# Altium schematic sheet door_clock.SchDoc
size 420 x 297 mm; SheetNumber: 2; SheetTotal: 2
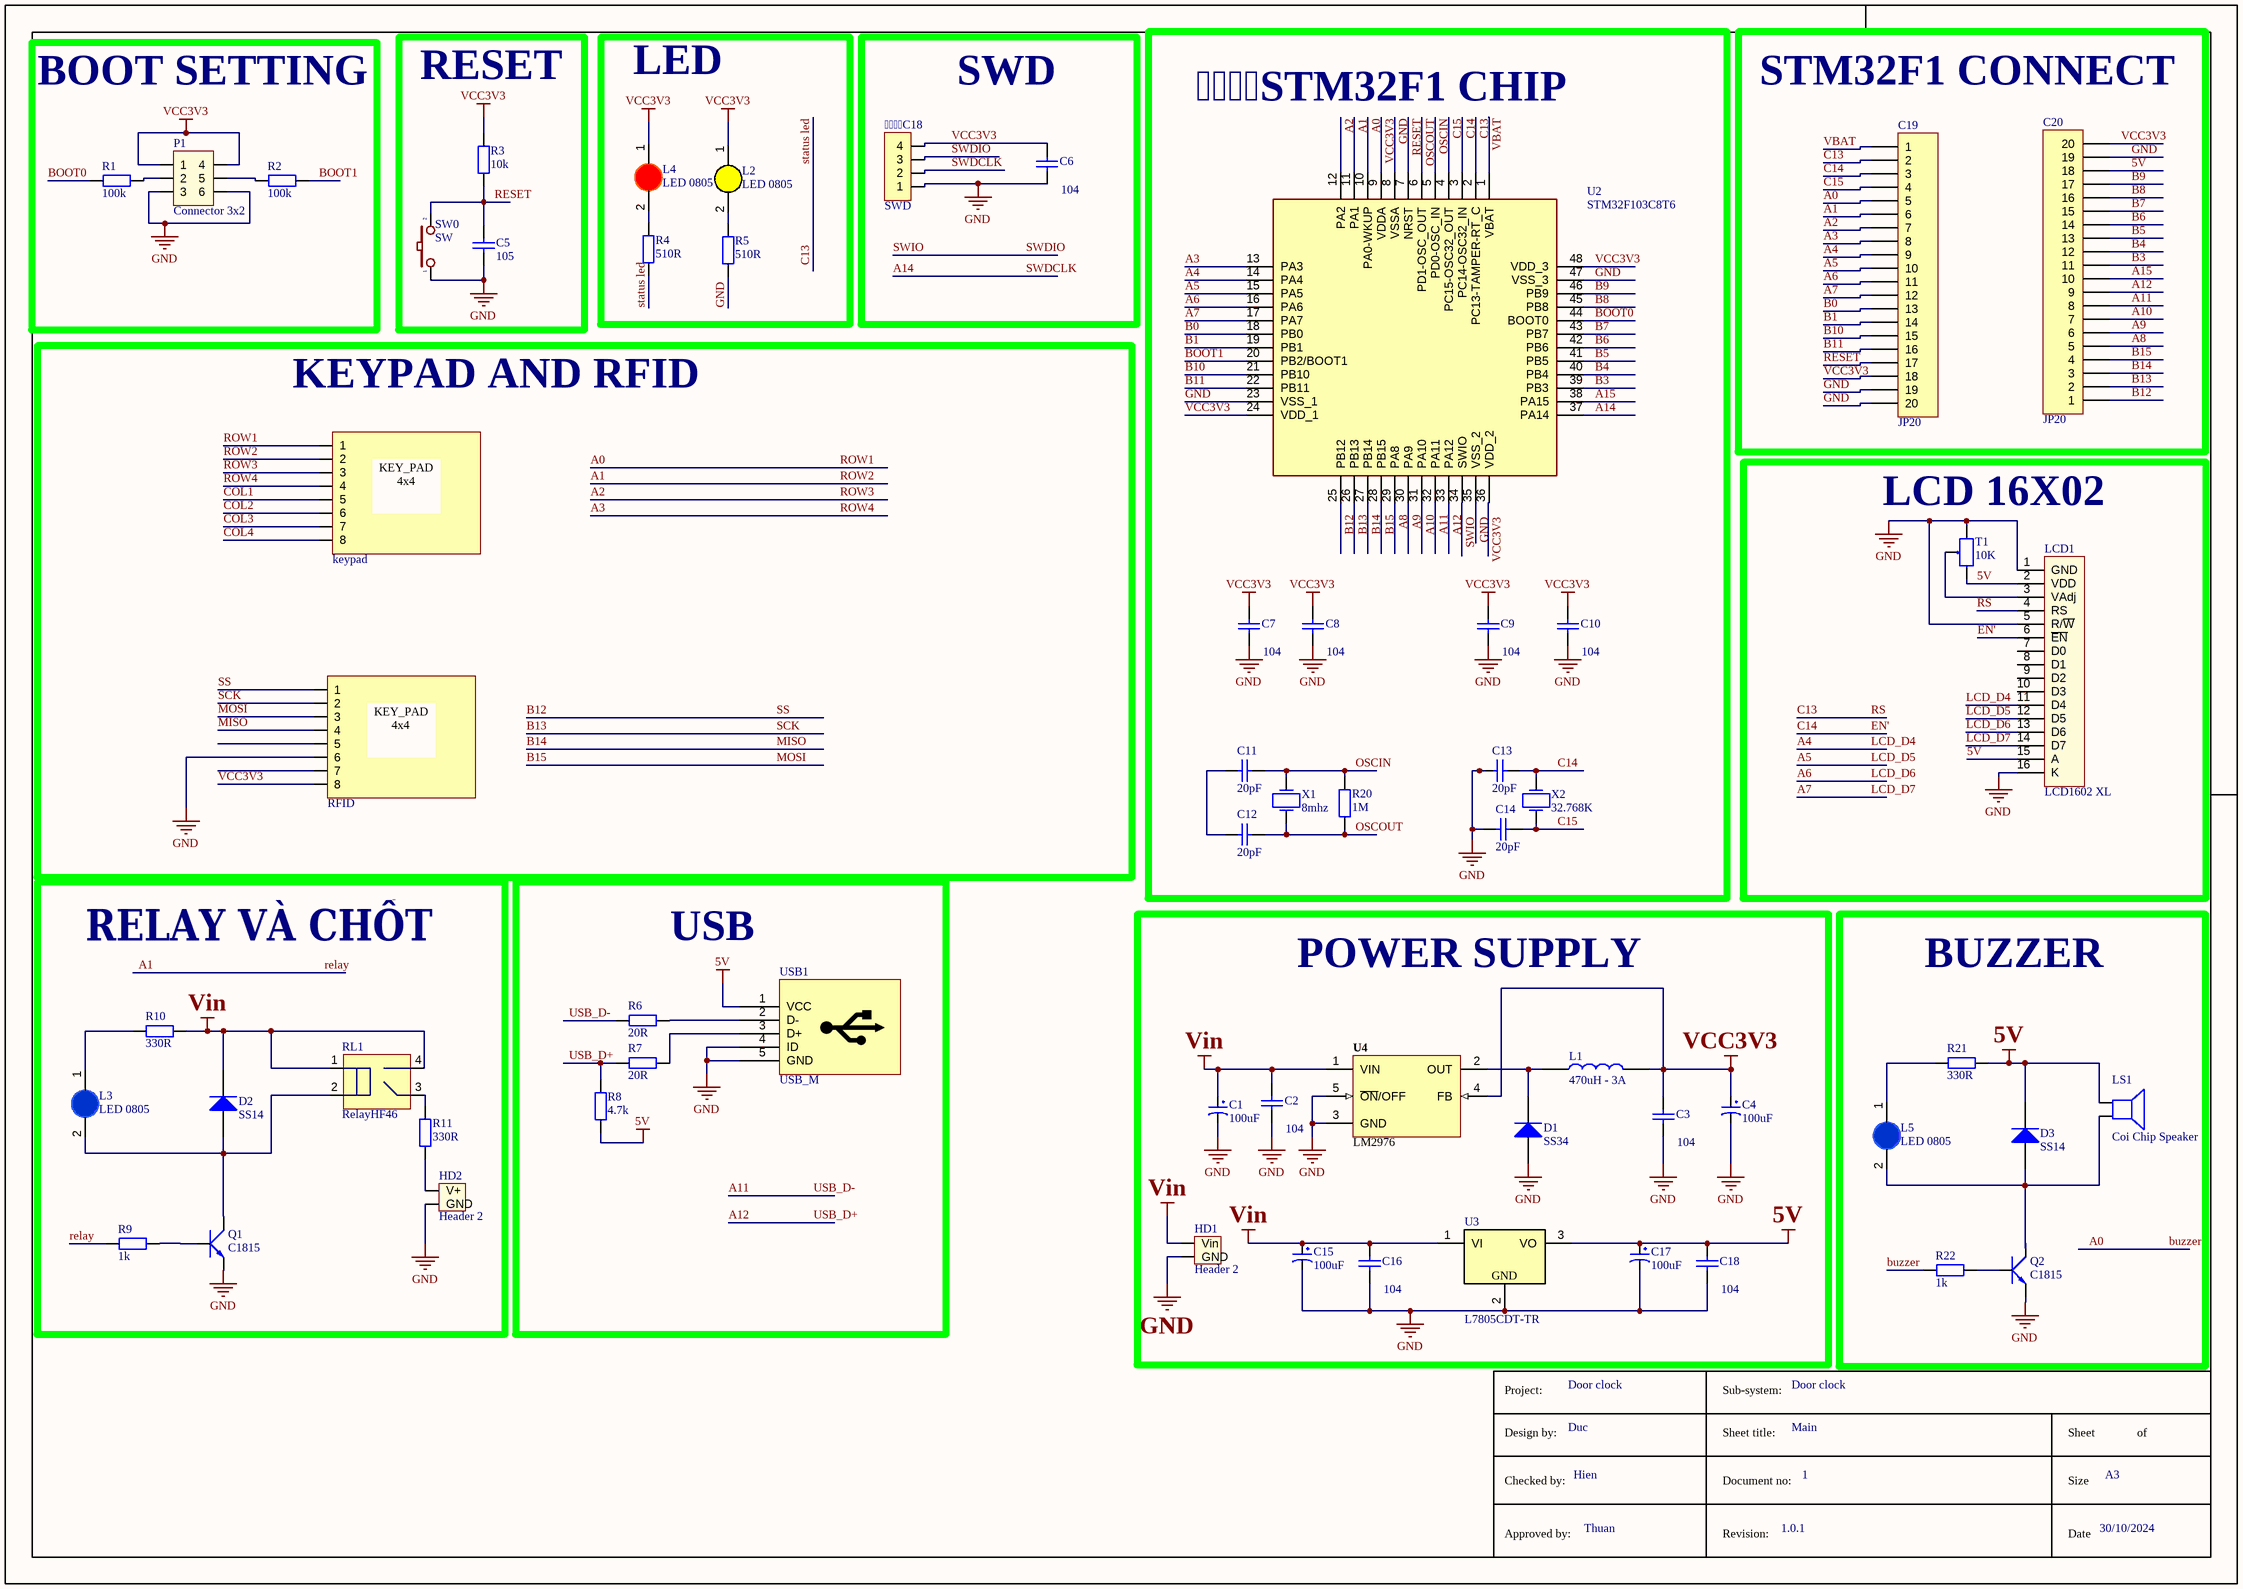
[diagram p0: door_clock.SchDoc]

## Parts
C18  SWD  [JP4-C1T]
C1  100uF  [tu hoa 8mm]
C2  104  [tu 0805]
C3  104  [tu 0805]
C4  100uF  [tu hoa 8mm]
C5  105  [tu 0603]
C6  104  [tu 0805]
C7  104  [tu 0805]
C8  104  [tu 0805]
C9  104  [tu 0805]
C10  104  [tu 0805]
C11  20pF  [tu 0805]
C12  20pF  [tu 0805]
C13  20pF  [tu 0805]
C14  20pF  [tu 0805]
C15  100uF  [tu hoa 8mm]
C16  104  [tu 0805]
C17  100uF  [tu hoa 8mm]
C18  104  [tu 0805]
C19  JP20  [JP20-C1T]
C20  JP20  [JP20-C1T]
D1  SS34  [DIODE SMA]
D2  SS14  [DIODE SMA]
D3  SS14  [DIODE SMA]
HD1  Header 2  [HED2]
HD2  Header 2  [HED2]
JP25  keypad  [JP 1x8 DT]
JP26  RFID  [JP 1x8 DT]
L1  470uH - 3A  [CUON CAM 100uH3A]
L2  LED 0805  [LED-0805-Yellow]
L3  LED 0805  [LED-0805-Blue]
L4  LED 0805  [LED-0805-Red]
L5  LED 0805  [LED-0805-Blue]
LCD1  LCD1602 XL  [LCD1602 with Jump]
LS1  Coi Chip Speaker  [Coi Chip Speacker]
P1  Connector 3x2  [JP3x2]
Q1  C1815  [TO92]
Q2  C1815  [TO92]
R1  100k  [tro smd 0603]
R2  100k  [tro smd 0603]
R3  10k  [tro smd 0603]
R4  510R  [tro smd 0603]
R5  510R  [tro smd 0603]
R6  20R  [tro smd 1206]
R7  20R  [tro smd 1206]
R8  4.7k  [tro smd 0603]
R9  1k  [tro smd 0805]
R10  330R  [Tro SMD 0805]
R11  330R  [Tro SMD 0805]
R20  1M  [tro smd 0805]
R21  330R  [Tro SMD 0805]
R22  1k  [tro smd 0805]
RL1  RelayHF46  [Relay 4 chan HF46F]
SW0  SW  [SW2]
T1  10K  [Bien Tro Vi Chinh Dung]
U2  STM32F103C8T6  [LQFP-48_19.6_393_58X11_SMD]
U3  L7805CDT-TR  [DPAK_118_446_112X59_SMD]
U4  LM2976  [TO263]
USB1  USB_M  [USB_B_MINI]
X1  8mhz  [XTAL_THG_HC49/US]
X2  32.768K  [XTAL_SMD3215]

## Blocks framed on the sheet
BOOT SETTING: P1 R1 R2
RESET: C5 R3 SW0
LED: L2 L4 R4 R5
SWD: C18 C6
STM32F1 CHIP: C7-C14 R20 U2 X1 X2
STM32F1 CONNECT: C19 C20
KEYPAD AND RFID: JP25 JP26
LCD 16X02: LCD1 T1
RELAY VÀ CHỐT: D2 HD2 L3 Q1 R9-R11 RL1
USB: R6-R8 USB1
POWER SUPPLY: C1-C4 C15-C18 D1 HD1 L1 U3 U4
BUZZER: D3 L5 LS1 Q2 R21 R22

## Nets
5V: C17.1 C18.1 C20.18 D3.2(K) LCD1.2(VDD) LCD1.15(A) LS1.1 R8.1 R21.2 T1.1 U3.3(VO) USB1.1(VCC)
GND: C18.1 C1.2 C2.2 C3.2 C4.2 C5.2 C6.2 C7.2 C8.2 C9.2 C10.2 C13.2 C14.2 C15.2 C16.2 C17.2 C18.2 C19.19 C19.20 C20.19 D1.1(A) HD1.2(GND) HD2.2(GND) JP26.6 LCD1.1(GND) LCD1.5(R/~{W}) LCD1.16(K) P1.3 P1.6 Q1.1(E) Q2.1(E) R5.1 SW0.1 T1.3 U2.8(VSSA) U2.23(VSS_1) U2.35(VSS_2) U2.47(VSS_3) U3.2 U4.3(GND) U4.5(~{ON}/OFF) USB1.4(ID) USB1.5(GND)
VCC3V3: C18.4 C3.1 C4.1 C6.1 C7.1 C8.1 C9.1 C10.1 C19.18 C20.20 JP26.8 L1.2 L2.1(A) L4.1(A) P1.1 P1.4 R3.2 U2.9(VDDA) U2.24(VDD_1) U2.36(VDD_2) U2.48(VDD_3) U4.4(FB)
Vin: C1.1 C2.1 C15.1 C16.1 D2.2(K) HD1.1(Vin) R10.2 RL1.1 RL1.4(AC/DC) U3.1(VI) U4.1(VIN)
A0: C19.5 JP25.1 R22.1 U2.10(PA0-WKUP)  [also labelled buzzer, ROW1]
A1: C19.6 JP25.2 R9.1 U2.11(PA1)  [also labelled relay, ROW2]
A2: C19.7 JP25.3 U2.12(PA2)  [also labelled ROW3]
A3: C19.8 JP25.4 U2.13(PA3)  [also labelled ROW4]
A4: C19.9 LCD1.11(D4) U2.14(PA4)  [also labelled LCD_D4]
A5: C19.10 LCD1.12(D5) U2.15(PA5)  [also labelled LCD_D5]
A6: C19.11 LCD1.13(D6) U2.16(PA6)  [also labelled LCD_D6]
A7: C19.12 LCD1.14(D7) U2.17(PA7)  [also labelled LCD_D7]
A8: C20.5 U2.29(PA8)
A9: C20.6 U2.30(PA9)
A10: C20.7 U2.31(PA10)
A11: C20.8 R6.1 U2.32(PA11)  [also labelled USB_D-]
A12: C20.9 R7.1 R8.2 U2.33(PA12)  [also labelled USB_D+]
A14: C18.2 U2.37(PA14)  [also labelled SWDCLK]
A15: C20.10 U2.38(PA15)
B0: C19.13 U2.18(PB0)
B1: C19.14 U2.19(PB1)
B3: C20.11 U2.39(PB3)
B4: C20.12 U2.40(PB4)
B5: C20.13 U2.41(PB5)
B6: C20.14 U2.42(PB6)
B7: C20.15 U2.43(PB7)
B8: C20.16 U2.45(PB8)
B9: C20.17 U2.46(PB9)
B10: C19.15 U2.21(PB10)
B11: C19.16 U2.22(PB11)
B12: C20.1 JP26.1 U2.25(PB12)  [also labelled SS]
B13: C20.2 JP26.2 U2.26(PB13)  [also labelled SCK]
B14: C20.3 JP26.4 U2.27(PB14)  [also labelled MISO]
B15: C20.4 JP26.3 U2.28(PB15)  [also labelled MOSI]
BOOT0: R1.1 U2.44(BOOT0)
BOOT1: R2.2 U2.20(PB2/BOOT1)
C13: C19.2 LCD1.4(RS) R4.1 U2.2(PC13-TAMPER-RT_C)  [also labelled RS, status led]
C14: C13.1 C19.3 LCD1.6(~{EN}) U2.3(PC14-OSC32_IN) X2.2(OSC2)  [also labelled EN']
C15: C14.1 C19.4 U2.4(PC15-OSC32_OUT) X2.1(OSC1)
COL1: JP25.5
COL2: JP25.6
COL3: JP25.7
COL4: JP25.8
OSCIN: C11.1 R20.2 U2.5(PD0-OSC_IN) X1.2(OSC2)
OSCOUT: C12.1 R20.1 U2.6(PD1-OSC_OUT) X1.1(OSC1)
RESET: C5.1 C19.17 R3.1 SW0.2 U2.7(NRST)
SWDIO: C18.3 U2.34(SWIO)  [also labelled SWIO]
VBAT: C19.1 U2.1(VBAT)
NetC11_2: C11.2 C12.2
NetD1_2: D1.2(K) L1.1 U4.2(OUT)
NetD2_1: D2.1(A) L3.2(K) Q1.2(C) RL1.2
NetD3_1: D3.1(A) L5.2(K) LS1.2 Q2.2(C)
NetHD2_1: HD2.1(V+) R11.1
NetL2_2: L2.2(K) R5.2
NetL3_1: L3.1(A) R10.1
NetL4_2: L4.2(K) R4.2
NetL5_1: L5.1(A) R21.1
NetLCD1_3: LCD1.3(VAdj) T1.2
NetP1_2: P1.2 R1.2
NetP1_5: P1.5 R2.1
NetQ1_3: Q1.3(B) R9.2
NetQ2_3: Q2.3(B) R22.2
NetR6_2: R6.2 USB1.2(D-)
NetR7_2: R7.2 USB1.3(D+)
NetR11_2: R11.2 RL1.3(AC/DC)

Not connected (* = marked no-connect by the designer): JP26 5 7; LCD1 7(D0) 8(D1) 9(D2) 10(D3)

## Notes on the sheet
- Project:
- Door clock
- Sub-system:
- Design by:
- Duc
- Sheet title:
- Main
- Sheet
- of
- Checked by:
- Approved by:
- Hien
- Thuan
- Document no:
- Revision:
- 1.0.1
- 1
- Size
- Date
- 30/10/2024
- A3
- (in symbol JP 1x8 2.54 Duc Thang) KEY_PAD 4x4
- (in symbol REG_35V_5V-1.5A-7.5W-DPAK) GND

## Library data of the parts
C18 = JP4: WR-PHD 2.54 mm Angled Socket Header; Manufacturer: W¨¹rth Elektronik eiSos GmbH; partNo: 613004143121; ComponentLink1 Description: Manufacturer; ComponentLink2 Description: Datasheet; NoPins: 04; Created Date: 29 March 2013; ComponentLink1URL: http://www.we-online.com; ComponentLink2URL: http://katalog.we-online.de/em/datasheet/6130xx143121.pdf; Created by: Karrer Zheng
C1 C4 C15 C17 = Tu Hoa 100uF 50V 8x11: Cắm; Don_Vi: Con; So_Chan: 2; Ten_Linh_Kien: Tụ Hóa 100uF 50V 8x11MM; Ma_Hang: MH006872; Chung_Loai: Cắm; Kieu_Chan: *
C2 C3 C6-C10 C16 C18 = Tu 0805 104 50V 10%: Dán; Don_Vi: Con; So_Chan: 2; Ten_Linh_Kien: Tụ 0805 104-100nF 10% 50V; Ma_Hang: MH004551; Chung_Loai: Dán; Kieu_Chan: *
C5 = Tu 0603 105 16V 20%: Dán; Don_Vi: Con; So_Chan: 2; Ten_Linh_Kien: Tụ 0603 105-1uF 20% 16V; Ma_Hang: MH004574; Chung_Loai: Dán; Kieu_Chan: *
C11-C14 = Tu 0805 20pF 50V 10%: Dán; Don_Vi: Con; Ten_Linh_Kien: Tụ 0805 20P 10% 50V; So_Chan: 2; Ma_Hang: MH004558; Chung_Loai: Dán; Kieu_Chan: *
C19 C20 = JP20: WR-PHD 2.54 mm Angled Socket Header; Manufacturer: W¨¹rth Elektronik eiSos GmbH; partNo: 613020143121; ComponentLink1 Description: Manufacturer; ComponentLink2 Description: Datasheet; NoPins: 20; Created Date: 29 March 2013; ComponentLink1URL: http://www.we-online.com; ComponentLink2URL: http://katalog.we-online.de/em/datasheet/6130xx143121.pdf; Created by: Karrer Zheng
D1 = Diode SS34 ( 1N5822 ): Dán; Don_Vi: Con; Ma_Hang: MH002104; Ten_Linh_Kien: Diode SS34 3A 40V SMA ( 1N5822 SS34A); Kieu_Chan: *; Chung_Loai: Dán
D2 D3 = Diode SS14 ( 1N5819): Dán; Ma_Hang: MH002211; Don_Vi: Con; Ten_Linh_Kien: Diode SS14 DO214 Schottky 1A 40V ( 1N5819 DO214); Chung_Loai: Dán; Ghi_Chu: *; Kieu_Chan: *
HD1 HD2 = Hed2: Header 2 (Green); Value: Header 2
JP25 JP26 = JP 1x8 2.54 Duc Thang: Cắm; Ten_Linh_Kien: Jump Đơn Đực 2.54MM 1x40P Thẳng 11MM; Don_Vi: Con; Ma_Hang: MH000903; Ghi_Chu: *; Kieu_Chan: *; Chung_Loai: Cắm
L1 = CUON CAM 470uH DIP: Cắm; Don_Vi: Con; Ma_Hang: MH002232; Ten_Linh_Kien: Cuộn Cảm 470uH 3A 8x10MM; Ghi_Chu: *; Kieu_Chan: *; Chung_Loai: Cắm
L2 = LED 0805 Vang: Dán; Don_Vi: Con; Ma_Hang: MH002329; Ten_Linh_Kien: LED 0805 Màu Vàng ( Yellow); Ghi_Chu: *; Kieu_Chan: *; Chung_Loai: Dán
L3 L5 = LED 0805 Xanh Duong: Dán; Don_Vi: Con; Ma_Hang: MH002327; Ten_Linh_Kien: LED 0805 Màu Xanh Dương (Blue); Ghi_Chu: *; Kieu_Chan: *; Chung_Loai: Dán
L4 = LED 0805 Do: Dán; Don_Vi: Con; Ma_Hang: MH000897; Ten_Linh_Kien: LED 0805 Màu Đỏ (Red); Ghi_Chu: *; Kieu_Chan: *; Chung_Loai: Dán
LCD1 = LCD1602 XL: LCD 1602 Xanh Lá; Ten: Màn hình LCD 1602 Xanh Lá; Ma_Hang: 67HZ; NCC: NSHOP; CHIP: HD44780
LS1 = Coi Chip Speaker: Còi chip
P1 = JP3x2: Value: Connector 3x2
Q1 Q2 = Trans C1815 DIP: NPN transistor; Value: C9014
R1 R2 = Tro 0603 5% 100k: Dán; So_Chan: 2; Ten_Linh_Kien: Trở 0603 5% 100k; Ma_Hang: MH006314; Don_Vi: Con; Chung_Loai: Dán; Kieu_Chan: *
R3 = Tro 0603 1% 10k: Dán; Don_Vi: Con; So_Chan: 2; Ten_Linh_Kien: Trở 0603 1% 10k; Ma_Hang: MH006333; Chung_Loai: Dán; Kieu_Chan: *
R4 R5 = Tro 0603 5% 510R: Dán; Don_Vi: Con; So_Chan: 2; Ten_Linh_Kien: Trở 0603 5% 510R; Ma_Hang: MH007667; Chung_Loai: Dán; Kieu_Chan: *
R6 R7 = Tro 1206 5% 20R: Dán; Don_Vi: Con; So_Chan: 2; Ten_Linh_Kien: Trở 1206 5% 20R; Ma_Hang: MH005911; Chung_Loai: Dán; Kieu_Chan: *
R8 = Tro 0603 5% 4.7k: Dán; Don_Vi: Con; So_Chan: 2; Ten_Linh_Kien: Trở 0603 5% 4.7k; Ma_Hang: MH006327; Chung_Loai: Dán; Kieu_Chan: *
R9 R22 = Tro 0805 1% 1k: Dán; Don_Vi: Con; So_Chan: 2; Ten_Linh_Kien: Trở 0805 1% 1k; Ma_Hang: MH005468; Chung_Loai: Dán; Kieu_Chan: *
R10 R11 R21 = Tro 0805 5% 330R: Dán; Don_Vi: Con; So_Chan: 2; Ten_Linh_Kien: Trở 0805 5% 330R; Ma_Hang: MH005337; Chung_Loai: Dán; Kieu_Chan: *
R20 = Tro 0805 1% 1M: Dán; Don_Vi: Con; So_Chan: 2; Ten_Linh_Kien: Trở 0805 1% 1M; Ma_Hang: MH005469; Chung_Loai: Dán; Kieu_Chan: *
RL1 = Relay 4 chan HF46F: Ten: Relay 5V5A HF46F-G 5-HS1; Ma_Hang: MH003879
SW0 = SW2: Switch button 2 pin; Value: SW chip 2 pin
T1 = Bien Tro Tinh Chinh 10K Dung: Cắm; Ma_Hang: MH003232; Ten_Linh_Kien: Biến Trở VR 103-10K 3296W; Don_Vi: Con; Kieu_Chan: *; Chung_Loai: Cắm; Ghi_Chu: *
U2 = IC_STM32F103C8T6: ARM® Cortex®-M3 STM32F1 Microcontroller IC 32-Bit 72MHz 64KB (64K x 8) FLASH 48-LQFP (7x7) /; Manufacturer: STMicroelectronics; Alternate Part Number-1: NA; Manufacturer Part Number: STM32F103C8T6; Case/Package: LQFP48; Supplier-1: LCSC; Supplier Part Number-1: STM32F103C8T6
U3 = REG_35V_5V-1.5A-7.5W-DPAK: Linear Voltage Regulator IC 1 Output 1.5A DPAK; Manufacturer: Diodes; Alternate Part Number-1: CJ7805 3%; Manufacturer Part Number: L7805CDT-TR; Case/Package: DPAK; Supplier-1: SP ROAD; Supplier Part Number-1: L7805CDT-TR
U4 = LM2596: Max Input Voltage: 12 V; Max Output Current: 3 (6.0 peak) A; Max Output Voltage: mV; Category: IC-Power; Min Input Voltage: mV; Min Output Voltage: mV; Mounting Technology: Surface Mount; Status: Unreleased; Supply Voltage: mV; Temperature Range: -40 to +125 degC
X1 = XTAL_9B-8.000MAAE-B: CRYSTAL 8.0000MHZ 12PF T/H; Manufacturer: TXC CORPORATION; Frequency Stability: ±30ppm; Operating Mode: Fundamental; Supplier 1: Digi-Key; Manufacturer Part Number: 9B-8.000MAAE-B; RoHS: RoHS Compliant; Category: Crystals, Oscillators, Resonators; Stock 1: 0; Pricing 1: 1000=0.192 (USD); Packaging: Bulk; Part Status: Active; Type: MHz Crystal; Frequency Tolerance: ±30ppm; Load Capacitance: 12pF; Operating Temperature: -20°C ~ 70°C; Ratings: -; Mounting Type: Through Hole; Package / Case: HC49/US; Size / Dimension: 0.453" L x 0.197" W (11.50mm x 5.00mm); Height - Seated (Max): 0.145" (3.68mm); ComponentLink1URL: http://www.txccorp.com/download/products/quartz_crystals/2015TXC_9B_33.pdf; ComponentLink1Description: http://www.txccorp.com/download/products/quartz_crystals/2015TXC_9B_33.pdf; Supplier Part Number 1: 9B-8.000MAAE-B-ND
X2 = XTAL_FC-135R 32.7680KA-E3: CRYSTAL 32.7680KHZ 6.0PF SMT; Manufacturer 1: EPSON; Category 1: Crystals, Oscillators, Resonators; Frequency: 32.768kHz; Frequency Tolerance: ±20ppm; Load Capacitance: 6pF; ESR (Equivalent Series Resistance): 50 kOhm; Operating Mode: Fundamental; Supplier 1: Digi-Key; Supplier Part Number 1: SER4074CT-ND; Manufacturer Part Number 1: FC-135R 32.7680KA-E3; RoHS 1: RoHS Compliant; Description 1: CRYSTAL 32.7680KHZ 6.0PF SMT; Stock 1: 1967; Pricing 1: 1=0.8, 10=0.708, 50=0.6622, 100=0.5852 (USD); Packaging: Cut Tape (CT); Part Status: Active; Type: kHz Crystal (Tuning Fork); Frequency Stability: -; Operating Temperature: -40°C ~ 85°C; Ratings: -; Mounting Type: Surface Mount; Package / Case: 2-SMD, No Lead; Size / Dimension: 0.126" L x 0.061" W (3.20mm x 1.50mm); Height - Seated (Max): 0.035" (0.90mm); ComponentLink1URL: https://support.epson.biz/td/api/doc_check.php?dl=brief_FC-135R_en.pdf; ComponentLink1Description: https://support.epson.biz/td/api/doc_check.php?dl=brief_FC-135R_en.pdf